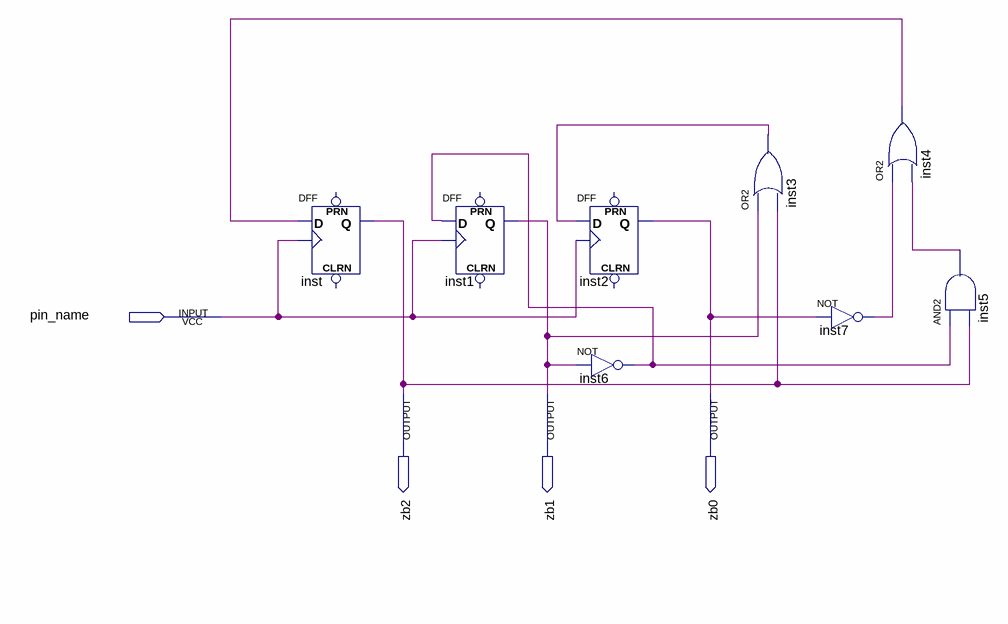
[diagram p0: schematic sheet]
// Quartus schematic ContadorTest.bdf as structural Verilog: 8 symbols, 4 pins
module ContadorTest (
  input  pin_name,
  output zb2,
  output zb1,
  output zb0
);

  wire inst3_out, inst4_out, inst5_out, inst6_out, inst7_out;

  DFF inst (.CLK(pin_name), .D(inst4_out), .Q(zb2));  // open: CLRN, PRN
  DFF inst1 (.CLK(pin_name), .D(inst6_out), .Q(zb1));  // open: CLRN, PRN
  DFF inst2 (.CLK(pin_name), .D(inst3_out), .Q(zb0));  // open: CLRN, PRN
  not inst6 (inst6_out, zb1);
  or inst3 (inst3_out, zb1, zb2);
  not inst7 (inst7_out, zb0);
  or inst4 (inst4_out, inst7_out, inst5_out);
  and inst5 (inst5_out, inst6_out, zb2);
endmodule
